# EAGLE design QFN-8_1.4x1.2_Breakout (EAGLE 9.6.2)
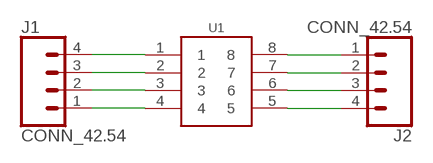
[diagram p0: schematic, sheet 1]

## Parts
J1  CONN_42.54  [1X04]
J2  CONN_42.54  [1X04]
U1  GEN_8QFN_1.4X1.2  [UQFN-8_1.4X1.2]

## Nets
N$1: J1.4 U1.1
N$2: J1.3 U1.2
N$3: J1.2 U1.3
N$4: J1.1 U1.4
N$5: J2.4 U1.5
N$6: J2.3 U1.6
N$7: J2.2 U1.7
N$8: J2.1 U1.8

## Library data of the parts
J1 J2 = bschulz:CONN_4: Genaric 4 terminal header Digikey 2.54_SCREW <https://www.digikey.com/product-detail/en/on-shore-technology-inc/OSTVN04A150/ED10563-ND/1588864>
U1 = bschulz:GEN_8: Generic 8 Pin Package for Breakout Boards

## Board
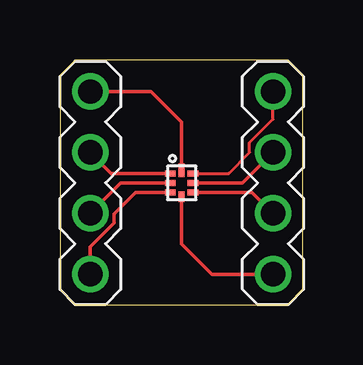
[diagram p1: board, top side]

Size 10.14 x 10.21 mm. Coordinates in mm from the lower left corner, seen from the top.
Outline: 10.14,0.64 10.14,9.58 9.51,10.21 0.64,10.21 0,9.58 0,0.64 0.64,0 9.51,0 10.14,0.64
Copper layers (1*16): Top 0.035559375mm / dielectric 1.6mm / Bottom 0.035559375mm
Design rules "jlcpcb-2layer": minimum track width 5mil, minimum drill 0.2mm, track to track 5mil, track to pad 6mil, pad to pad 5mil, via to via 6mil, smd to smd 5mil, copper to edge 15mil, drill to drill 6mil, minimum pad ring 5mil, minimum via ring 5mil, stop-mask expansion 2.5mil, vias tented up to drill 0mil, thermal gap 10mil

### Footprints (pad centres in the part's own frame; a part is rotated, then mirrored left to right if it is on the bottom)
1X04 = drill 1.016: 1 -3.81,0; 2 -1.27,0; 3 1.27,0; 4 3.81,0
UQFN-8_1.4X1.2 = smd 0.55 x 0.25: 1 -0.53,0 | smd 0.25 x 0.45: 2 -0.4,-0.475; 3 0,-0.475; 4 0.4,-0.475; 6 0.4,0.475; 7 0,0.475; 8 -0.4,0.475 | smd 0.45 x 0.25: 5 0.58,0

### Placement (x,y rotation side)
J1  1.27,5.08 90 top
J2  8.89,5.08 270 top
U1  5.08,5.08 270 top

### Tracks (layer width: path | path; a pad name or v marks a point on that pad's centre or on a via)
N$1
  Top 0.152: U1.1 5.08,7.62 3.81,8.89 J1.4
N$2
  Top 0.152: U1.2 2.14,5.48 J1.3
N$3
  Top 0.152: U1.3 2.54,5.08 J1.2
N$4
  Top 0.152: U1.4 3.16,4.68 2.26,3.79 2.26,3.4 1.27,2.41 J1.1
N$5
  Top 0.152: U1.5 5.08,2.54 6.35,1.27 J2.4
N$6
  Top 0.152: U1.6 8.02,4.68 J2.3
N$7
  Top 0.152: J2.2 7.62,5.08 U1.7
N$8
  Top 0.127: U1.8 7.04,5.48 7.91,6.35 7.91,6.75 8.89,7.73 J2.1

### Text on the board
tDocu: 1 | 8 | UQFN-8 / 1.4x1.2mm | 2 | 7 | 3 | 6 | Break44 / B. Schulz | 4 | 5